# Altium schematic sheet CSD18533Q5A1_CSD18533Q5A.schdoc
size 124 x 101 mm
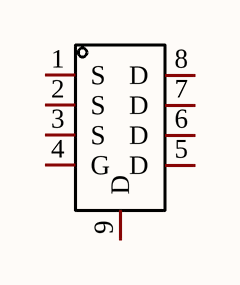
[diagram p0: CSD18533Q5A1_CSD18533Q5A.schdoc]

## Parts
Q?  CSD18533Q5A  [PQFN-8_L5.8-W4.9-P1.27-LS6.0-BL]  (value not drawn)

## Nets

Not connected (* = marked no-connect by the designer): Q? 1(S) 2(S) 3(S) 4(G) 5(D) 6(D) 7(D) 8(D) 9(D)

## Library data of the parts
Q? = CSD18533Q5A: Manufacturer: TI(德州仪器); Add into BOM: yes; Type: 1个N沟道; Drain Source Voltage (Vdss): 60V; Continuous Drain Current (Id): 17A；100A; Power Dissipation (Pd): 3.2W；116W; Drain Source On Resistance (RDS(on)@Vgs,Id): 5.9mΩ@10V,18A; Gate Threshold Voltage (Vgs(th)@Id): 2.3V@250uA; Total Gate Charge (Qg@Vgs): 36nC@10V; Input Capacitance (Ciss@Vds): 2.75nF@30V; Symbol: CSD18533Q5A; Device: CSD18533Q5A; LCSC Part Name: 1个N沟道 耐压:60V 电流:17A 电流:100A; Supplier Part: C130170; Manufacturer Part: CSD18533Q5A; Supplier Footprint: VSONP-8(5x6); JLCPCB Part Class: Extended Part; Datasheet: https://www.ti.com/cn/lit/gpn/csd18533q5a; Supplier: LCSC; Convert to PCB: yes; Operating Temperature: -55℃~+150℃@(Tj)